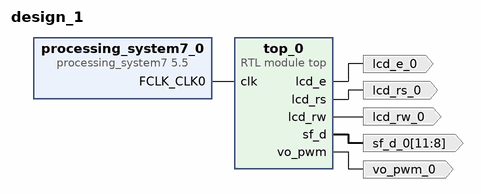
[diagram p0: block diagram of the top level]
# Vivado block design design_1, xc7z020clg400-1, Vivado 2025.1
create_bd_design design_1

create_bd_port -dir O lcd_e_0
create_bd_port -dir O lcd_rs_0
create_bd_port -dir O lcd_rw_0
create_bd_port -dir O -from 11 -to 8 sf_d_0
create_bd_port -dir O vo_pwm_0

create_bd_cell -type ip -vlnv xilinx.com:ip:processing_system7:5.5 processing_system7_0
set_property -dict [list \
  CONFIG.PCW_EN_RST0_PORT 0 \
  CONFIG.PCW_UIPARAM_DDR_ENABLE 0 \
  CONFIG.PCW_USE_M_AXI_GP0 0 \
] [get_bd_cells processing_system7_0]
# 30 more settings of processing_system7_0 are not shown: defaults, MIO pin electricals, DDR timing, and values the tool derives
create_bd_cell -type module -reference top top_0

# ---- connections ----

connect_bd_net [get_bd_pins processing_system7_0/FCLK_CLK0] [get_bd_pins top_0/clk]
connect_bd_net [get_bd_pins top_0/lcd_e] [get_bd_ports lcd_e_0]
connect_bd_net [get_bd_pins top_0/lcd_rs] [get_bd_ports lcd_rs_0]
connect_bd_net [get_bd_pins top_0/lcd_rw] [get_bd_ports lcd_rw_0]
connect_bd_net [get_bd_pins top_0/sf_d] [get_bd_ports sf_d_0]
connect_bd_net [get_bd_pins top_0/vo_pwm] [get_bd_ports vo_pwm_0]

validate_bd_design
save_bd_design
